# Altium schematic sheet W25Q256.SchDoc
size A4
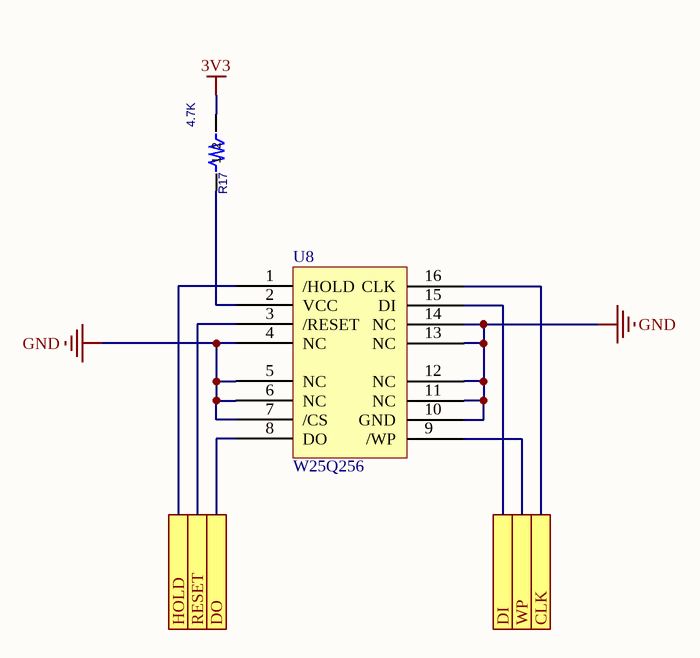
[diagram p0: W25Q256.SchDoc]

## Parts
R17  value 4.7K  [RES_0603_FIRE]  (hidden comment: RES_4K7_0603_FIRE)
U8  W25Q256  [W25Q256]

## Ports
CLK, DI, DO, HOLD, RESET, WP

## Nets
3V3: R17.2
GND: U8.4(NC) U8.5(NC) U8.6(NC) U8.7(/CS) U8.10(GND) U8.11(NC) U8.12(NC) U8.13(NC) U8.14(NC)
CLK: U8.16(CLK) ; port CLK
DI: U8.15(DI) ; port DI
DO: U8.8(DO) ; port DO
HOLD: U8.1(/HOLD) ; port HOLD
RESET: U8.3(/RESET) ; port RESET
WP: U8.9(/WP) ; port WP
NetR17_1: R17.1 U8.2(VCC)

## Library data of the parts
R17 = RES_4K7_0603_FIRE: 0402; Manufacture 1: SUPEROHM; Tolerance: +-5%; PCB DECAL: RES_0603_FIRE